# EAGLE schematic outyo (EAGLE 8.5.2)
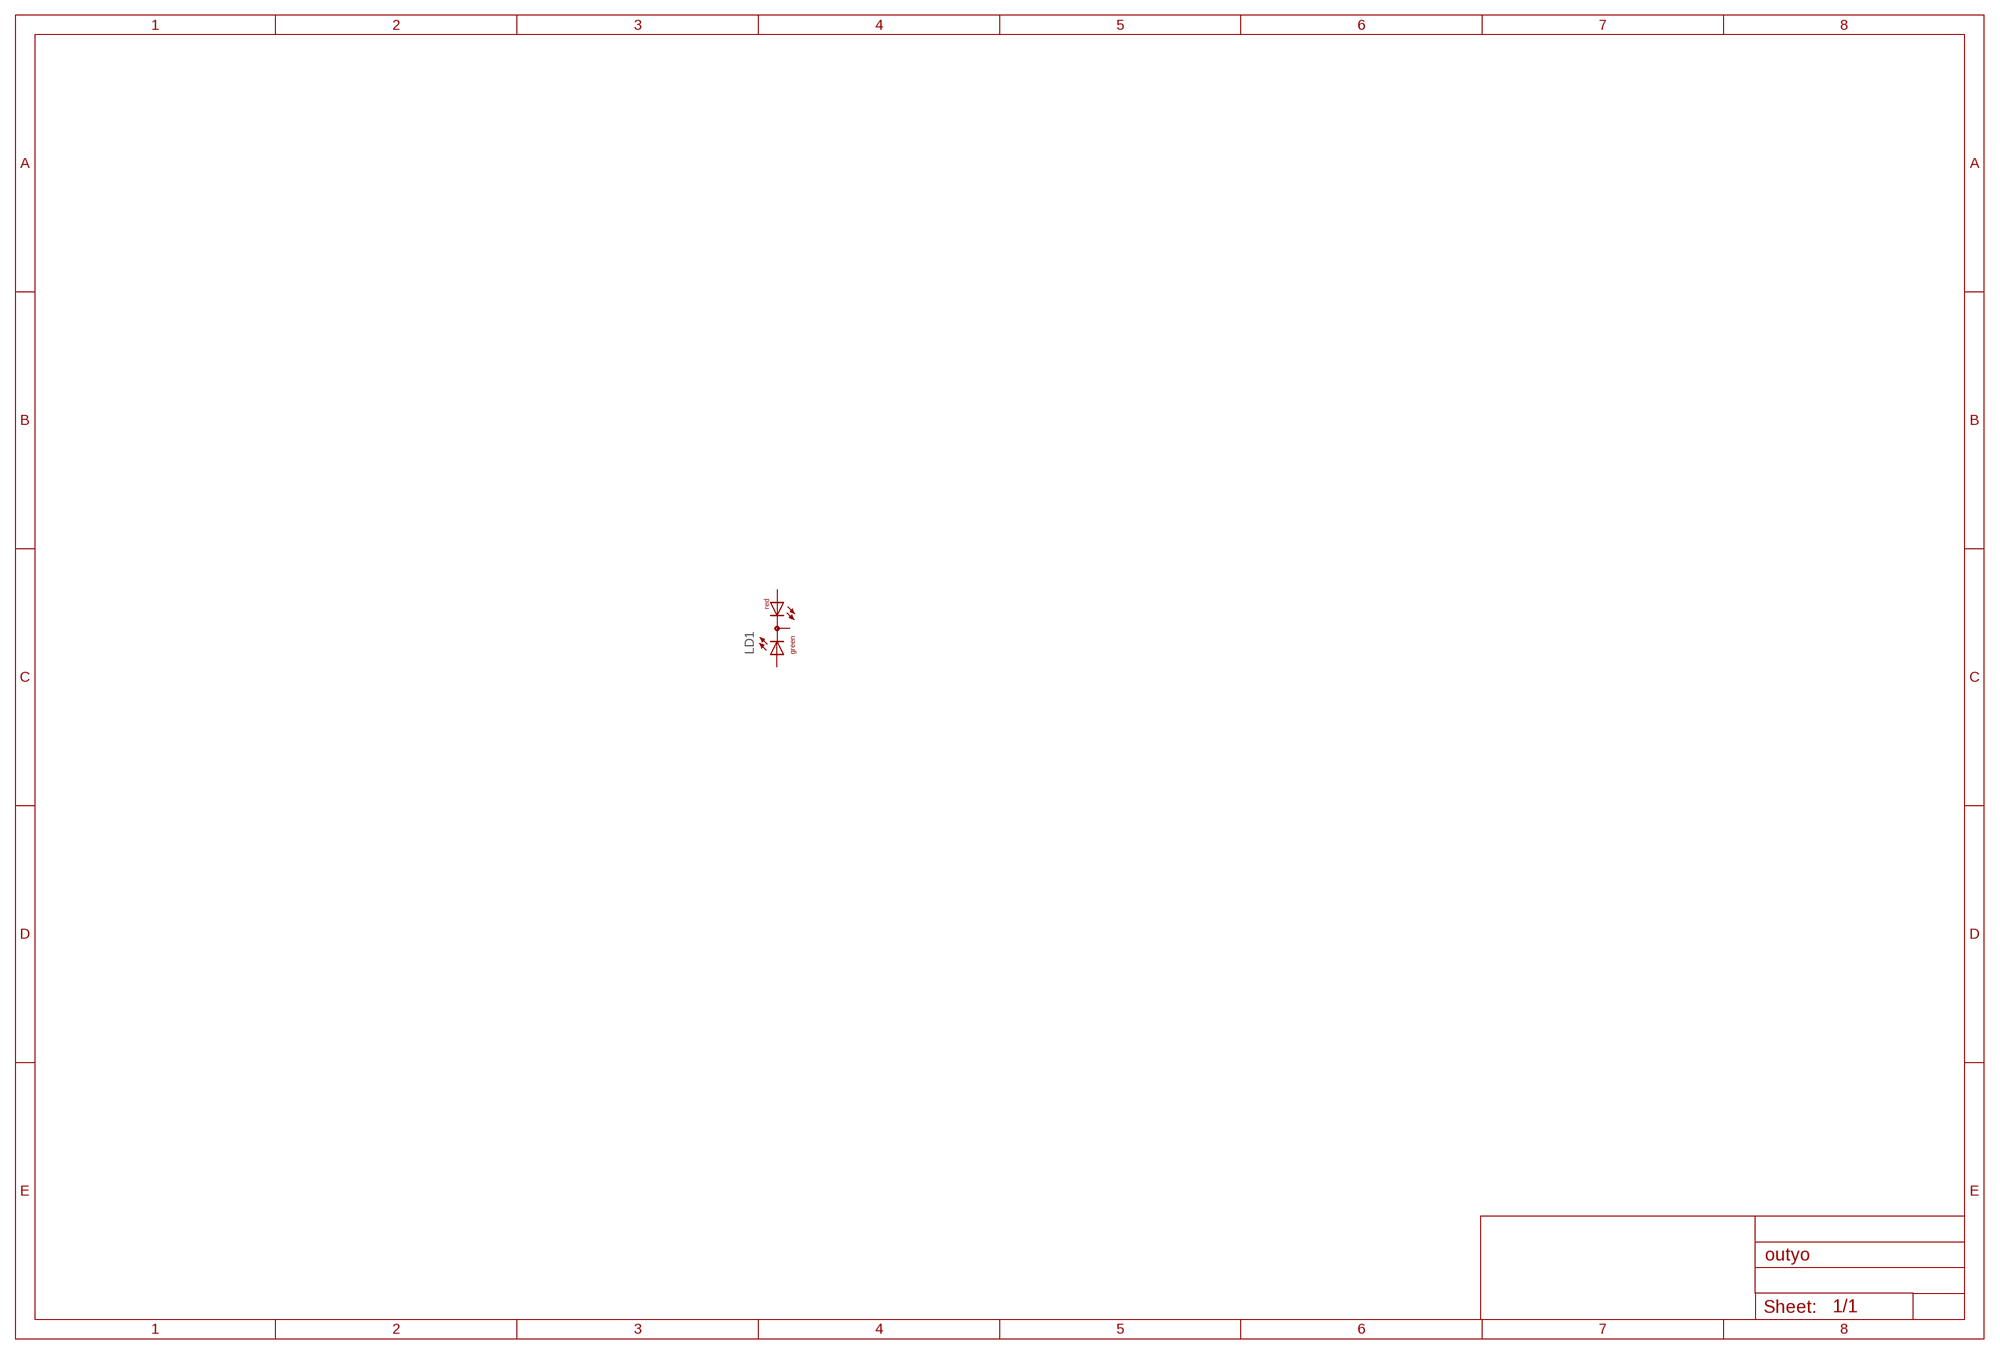
[diagram p0: schematic, sheet 1]

## Parts
LD1  DUOLED-RG-C  [DUOLED-C-5MM]
Unconnected: LD1.AR LD1.AX(AG) LD1.C

## Library data of the parts
LD1 = led:DUOLED-RG-C: DUO LED 2 colors (red/green), 5 mm, round, common Cathode www.ligitek.com or other producers.